# Altium project Mesh_Main_PCB.PrjPcb
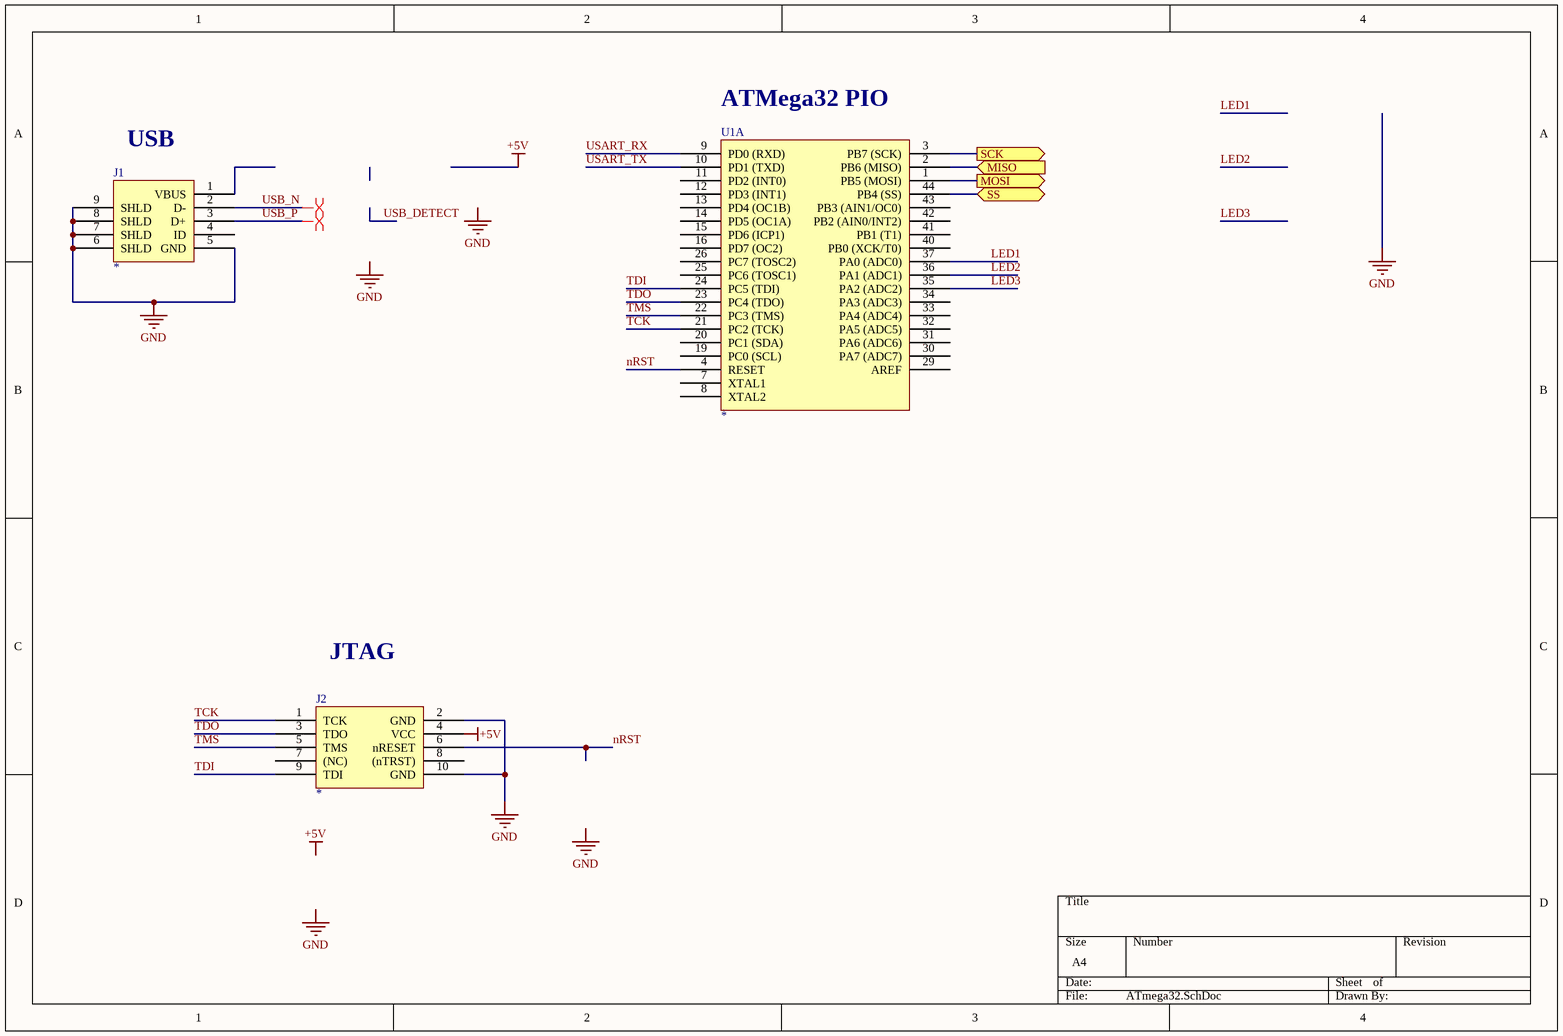
[diagram p0: ATmega32.SchDoc]
3 sheets, 4 parts. Net scope: flat (ports and power ports of the same name join across sheets).
Sheets:
  ATmega32.SchDoc
  Power.SchDoc
  RFM12BS.SchDoc

## Sheet ATmega32.SchDoc
size A4

### Parts
J1  *
J2  *
U1  *  (part A of 2)

### Ports
MISO (in), MOSI (out), SCK (out), SS

### Nets
+5V: J2.4(VCC)
GND: J1.5(GND) J1.6(SHLD) J1.7(SHLD) J1.8(SHLD) J1.9(SHLD) J2.2(GND) J2.10(GND)
LED1: U1.37(PA0_(ADC0))
LED2: U1.36(PA1_(ADC1))
LED3: U1.35(PA2_(ADC2))
nRST: J2.6(nRESET) U1.4(RESET)
TCK: J2.1(TCK) U1.21(PC2_(TCK))
TDI: J2.9(TDI) U1.24(PC5_(TDI))
TDO: J2.3(TDO) U1.23(PC4_(TDO))
TMS: J2.5(TMS) U1.22(PC3_(TMS))
USART_RX: U1.9(PD0_(RXD))
USART_TX: U1.10(PD1_(TXD))
USB_N: J1.2(D-)
USB_P: J1.3(D+)
NetU1_1: U1.1(PB5_(MOSI)) ; port MOSI
NetU1_2: U1.2(PB6_(MISO)) ; port MISO
NetU1_3: U1.3(PB7_(SCK)) ; port SCK
NetU1_44: U1.44(PB4_(SS)) ; port SS

Not connected (* = marked no-connect by the designer): J1 1(VBUS) 4(ID); J2 7((NC)) 8((nTRST)); U1 7(XTAL1) 8(XTAL2) 11(PD2_(INT0)) 12(PD3_(INT1)) 13(PD4_(OC1B)) 14(PD5_(OC1A)) 15(PD6_(ICP1)) 16(PD7_(OC2)) 19(PC0_(SCL)) 20(PC1_(SDA)) 25(PC6_(TOSC1)) 26(PC7_(TOSC2)) 29(AREF) 30(PA7_(ADC7)) 31(PA6_(ADC6)) 32(PA5_(ADC5)) 33(PA4_(ADC4)) 34(PA3_(ADC3)) 40(PB0_(XCK/T0)) 41(PB1_(T1)) 42(PB2_(AIN0/INT2)) 43(PB3_(AIN1/OC0))

### Layout directives
differential pair: USB_N, USB_P

### Notes on the sheet
- (near U1) ATMega32 PIO
- (near J1) USB
- JTAG
- Labels drawn without touching a wire or pin: +5V, GND

### Library data of the parts
J1 = USB MICRO B
J2 = JTAG Header
U1 = ATmega32

## Sheet Power.SchDoc
size A4
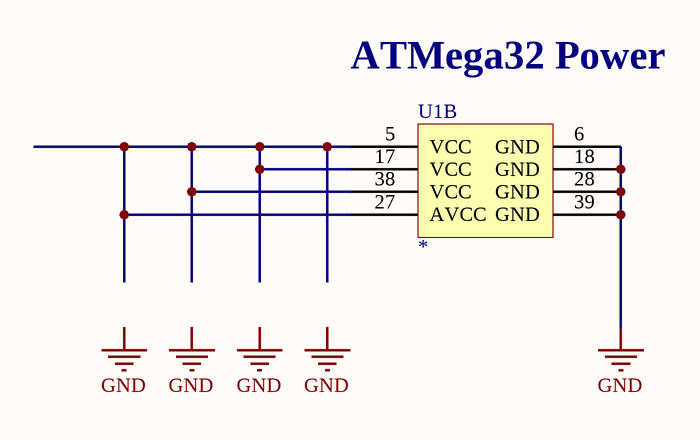
[diagram p1: Power.SchDoc]

### Parts
U1  *  (part B of 2)

### Nets
GND: U1.6(GND) U1.18(GND) U1.28(GND) U1.39(GND)
NetU1_5: U1.5(VCC) U1.17(VCC) U1.27(AVCC) U1.38(VCC)

### Notes on the sheet
- (near U1) ATMega32 Power
- Labels drawn without touching a wire or pin: GND

### Library data of the parts
U1 = ATmega32

## Sheet RFM12BS.SchDoc
size A4
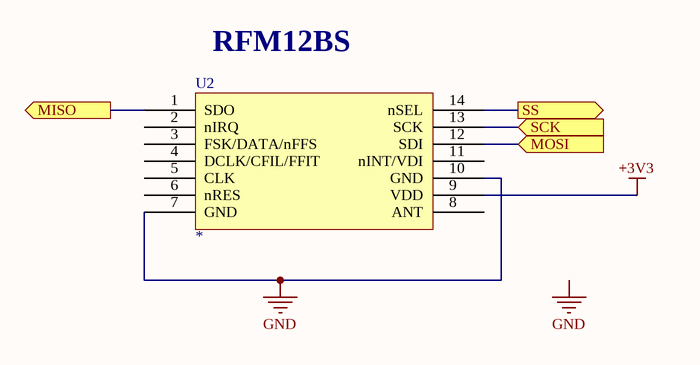
[diagram p2: RFM12BS.SchDoc]

### Parts
U2  *

### Ports
MISO (out), MOSI (in), SCK (in), SS (out)

### Nets
+3V3: U2.9(VDD)
GND: U2.7(GND) U2.10(GND)
NetU1_1: U2.12(SDI) ; port MOSI
NetU1_2: U2.1(SDO) ; port MISO
NetU1_3: U2.13(SCK) ; port SCK
NetU1_44: U2.14(nSEL) ; port SS

Not connected (* = marked no-connect by the designer): U2 2(nIRQ) 3(FSK/DATA/nFFS) 4(DCLK/CFIL/FFIT) 5(CLK) 6(nRES) 8(ANT) 11(nINT/VDI)

### Notes on the sheet
- (near U2) RFM12BS
- Labels drawn without touching a wire or pin: GND

### Library data of the parts
U2 = RFM12BS

## Nets that join several sheets
GND: ATmega32 (7 pins), Power (U1.6 U1.18 U1.28 U1.39), RFM12BS (U2.7 U2.10)
NetU1_1: ATmega32 (U1.1), RFM12BS (U2.12)
NetU1_2: ATmega32 (U1.2), RFM12BS (U2.1)
NetU1_3: ATmega32 (U1.3), RFM12BS (U2.13)
NetU1_44: ATmega32 (U1.44), RFM12BS (U2.14)